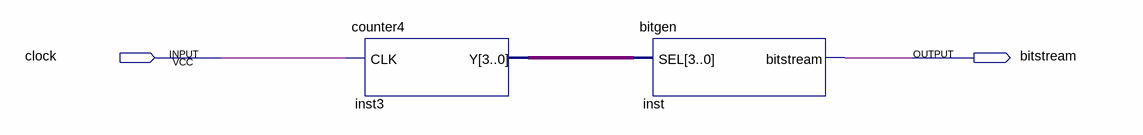
[diagram p0: schematic sheet]
// Quartus schematic helloworld.bdf as structural Verilog: 2 symbols, 2 pins
module helloworld (
  input  clock,
  output bitstream
);

  wire [3:0] inst3_y;

  counter4 inst3 (.CLK(clock), .Y(inst3_y));
  bitgen inst (.SEL(inst3_y), .bitstream(bitstream));
endmodule
